# Altium project CCI_Mouse.PrjPcb
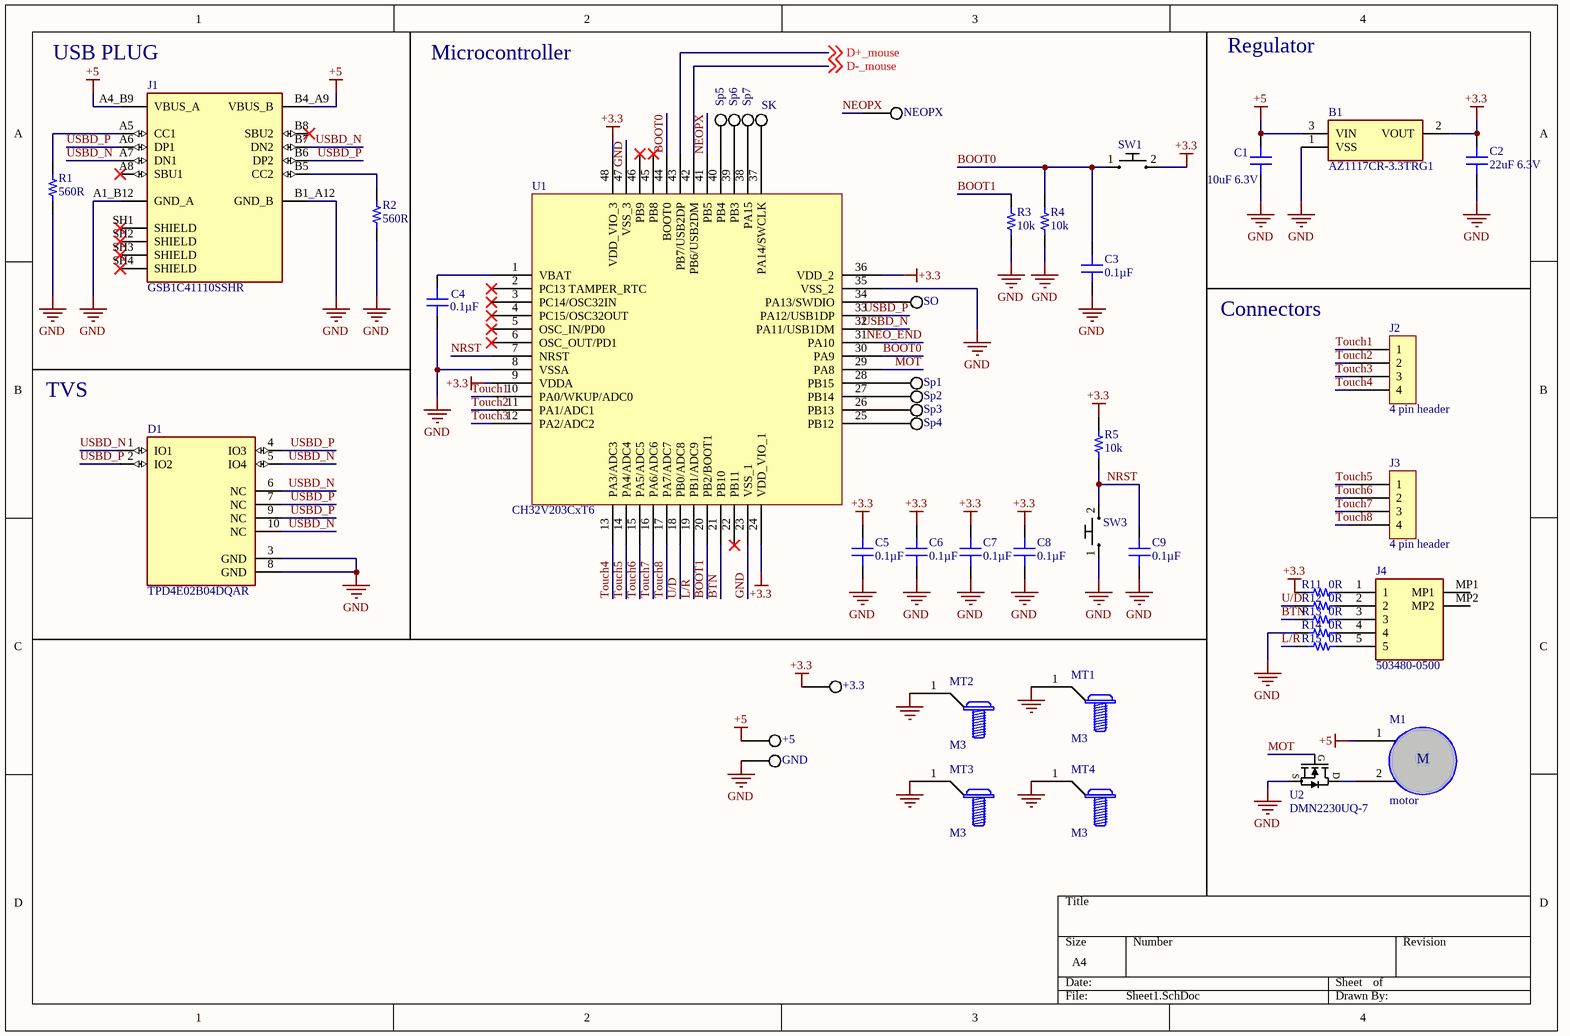
[diagram p0: Sheet1.SchDoc]
1 sheet, 47 parts. Net scope: global (net labels, ports and power ports of the same name join across sheets).
Board file: PCB1.PcbDoc

## Sheet Sheet1.SchDoc
size A4; SheetNumber: 1; SheetTotal: 2

### Parts
+3.3  TestPoint  [TP2020]  (value not drawn)
+5  TestPoint  [TP2020]  (value not drawn)
B1  AZ1117CR-3.3TRG1  [SOT89-3]
C1  10uF 6.3V  [CAP 0603_1608]
C2  22uF 6.3V  [CAP 0603_1608]
C3  0.1µF  [CAP 0603_1608]
C4  0.1µF  [CAP 0603_1608]
C5  0.1µF  [CAP 0603_1608]
C6  0.1µF  [CAP 0603_1608]
C7  0.1µF  [CAP 0603_1608]
C8  0.1µF  [CAP 0603_1608]
C9  0.1µF  [CAP 0603_1608]
D1  TPD4E02B04DQAR  [DIO_TPD4E02B04DQAR]
GND  TestPoint  [TP2020]  (value not drawn)
J1  GSB1C41110SSHR  [AMPHENOL_GSB1C41110SSHR]
J2  4 pin header  [4 pin header]
J3  4 pin header  [4 pin header]
J4  503480-0500  [5034800500]
M1  motor  [2 pin header]
MT1  M3  [M3_MT_HOLE]
MT2  M3  [M3_MT_HOLE]
MT3  M3  [M3_MT_HOLE]
MT4  M3  [M3_MT_HOLE]
NEOPX  TestPoint  [TP2020]  (value not drawn)
R1  560R  [RES 0603_1608]
R2  560R  [RES 0603_1608]
R3  10k  [RES 0603_1608]
R4  10k  [RES 0603_1608]
R5  10k  [RES 0603_1608]
R11  0R  [RES 0603_1608]
R12  0R  [RES 0603_1608]
R13  0R  [RES 0603_1608]
R14  0R  [RES 0603_1608]
R15  0R  [RES 0603_1608]
SK  TestPoint  [TP2020]  (value not drawn)
SO  TestPoint  [TP2020]  (value not drawn)
Sp1  TestPoint  [TP2020]  (value not drawn)
Sp2  TestPoint  [TP2020]  (value not drawn)
Sp3  TestPoint  [TP2020]  (value not drawn)
Sp4  TestPoint  [TP2020]  (value not drawn)
Sp5  TestPoint  [TP2020]  (value not drawn)
Sp6  TestPoint  [TP2020]  (value not drawn)
Sp7  TestPoint  [TP2020]  (value not drawn)
SW1  SPST_BUTTON  [3x4mmBTN]  (value not drawn)
SW3  SPST_BUTTON  [3x4mmBTN]  (value not drawn)
U1  CH32V203CxT6  [LQFP48]
U2  DMN2230UQ-7  [DMN2230UQ_DIO-M]

### Nets
+3.3: +3.3.TP B1.2(VOUT) C2.2 C5.2 C6.2 C7.2 C8.2 R5.2 R11.1 SW1.2 U1.9(VDDA) U1.24(VDD_VIO_1) U1.36(VDD_2) U1.48(VDD_VIO_3)
+5: +5.TP B1.3(VIN) C1.2 J1.A4_B9(VBUS_A) J1.B4_A9(VBUS_B) M1.1
GND: B1.1(VSS) C1.1 C2.1 C3.1 C4.1 C5.1 C6.1 C7.1 C8.1 C9.1 D1.3(GND) D1.8(GND) GND.TP J1.A1_B12(GND_A) J1.B1_A12(GND_B) MT1.1 MT2.1 MT3.1 MT4.1 R1.1 R2.1 R3.1 R4.1 R14.1 SW3.1 U1.8(VSSA) U1.23(VSS_1) U1.35(VSS_2) U1.47(VSS_3) U2.3(S)
BOOT0: C3.2 R4.2 SW1.1 U1.30(PA9) U1.44(BOOT0)
BOOT1: R3.2 U1.20(PB2/BOOT1)
BTN: R13.1 U1.21(PB10)
D+_mouse: U1.43(PB7/USB2DP) ; off-sheet D+_mouse
D-_mouse: U1.42(PB6/USB2DM) ; off-sheet D-_mouse
L/R: R15.1 U1.19(PB1/ADC9)
MOT: U1.29(PA8) U2.2(G)
NEO_END: U1.31(PA10)
NEOPX: NEOPX.TP U1.41(PB5)
NRST: C9.2 R5.1 SW3.2 U1.7(NRST)
Touch1: J2.1 U1.10(PA0/WKUP/ADC0)
Touch2: J2.2 U1.11(PA1/ADC1)
Touch3: J2.3 U1.12(PA2/ADC2)
Touch4: J2.4 U1.13(PA3/ADC3)
Touch5: J3.1 U1.14(PA4/ADC4)
Touch6: J3.2 U1.15(PA5/ADC5)
Touch7: J3.3 U1.16(PA6/ADC6)
Touch8: J3.4 U1.17(PA7/ADC7)
U/D: R12.1 U1.18(PB0/ADC8)
USBD_N: D1.1(IO1) D1.5(IO4) D1.6(NC) D1.10(NC) J1.A7(DN1) J1.B7(DN2) U1.32(PA11/USB1DM)
USBD_P: D1.2(IO2) D1.4(IO3) D1.7(NC) D1.9(NC) J1.A6(DP1) J1.B6(DP2) U1.33(PA12/USB1DP)
NetC4_2: C4.2 U1.1(VBAT)
NetJ1_A5: J1.A5(CC1) R1.2
NetJ1_B5: J1.B5(CC2) R2.2
NetJ4_1: J4.1 R11.2
NetJ4_2: J4.2 R12.2
NetJ4_3: J4.3 R13.2
NetJ4_4: J4.4 R14.2
NetJ4_5: J4.5 R15.2
NetM1_2: M1.2 U2.1(D)
NetSK_TP: SK.TP U1.37(PA14/SWCLK)
NetSO_TP: SO.TP U1.34(PA13/SWDIO)
NetSp1_TP: Sp1.TP U1.28(PB15)
NetSp2_TP: Sp2.TP U1.27(PB14)
NetSp3_TP: Sp3.TP U1.26(PB13)
NetSp4_TP: Sp4.TP U1.25(PB12)
NetSp5_TP: Sp5.TP U1.40(PB4)
NetSp6_TP: Sp6.TP U1.39(PB3)
NetSp7_TP: Sp7.TP U1.38(PA15)

Not connected (* = marked no-connect by the designer): J1 A8(SBU1)* B8(SBU2)* SH1(SHIELD)* SH2(SHIELD)* SH3(SHIELD)* SH4(SHIELD)*; J4 MP1 MP2; U1 2(PC13_TAMPER_RTC)* 3(PC14/OSC32IN)* 4(PC15/OSC32OUT)* 5(OSC_IN/PD0)* 6(OSC_OUT/PD1)* 22(PB11)* 45(PB8)* 46(PB9)*

### Notes on the sheet
- (near J1) USB PLUG
- Microcontroller
- Regulator
- Connectors
- TVS
- (in symbol VibrationMotor) M

### Library data of the parts
+3.3 +5 GND NEOPX SK SO Sp1-Sp7 = JMP-RTZL7I: PC TEST POINT MINIATURE; Manufacturer: Keystone Electronics; SCH_Comment: 5015 TestPoint; Part Number: JMP-RTZL7I; Supplier 1: DigiKey; Supplier Part Number 1: 36-5015TR-ND
B1 = TRS-RTZP45: 3.3v LDO Voltage regulator; Manufacturer_Name: Torex; Manufacturer_Part_Number: XC6206P331MR-G; Geometry.Height: 1.3mm; SCH_Comment: AZ1117CR33; Mouser Part Number: 865-XC6206P331MR-G; Mouser Price/Stock: https://www.mouser.co.uk/ProductDetail/Torex-Semiconductor/XC6206P331MR-G?qs=AsjdqWjXhJ%252B7jjWBpr1yow%3D%3D; Datasheet Link: https://www.torexsemi.com/file/xc6206/XC6206.pdf; Part Number: TRS-RTZP45; Supplier 1: Digi-key; JLC PartNumber: C460428; Supplier Part Number 1: AZ1117CR-3.3TRG1DICT-ND
C1 = CAP0603-RU10OA: CAP CER 10uF; Manufacturer: YAGEO; Tolerance: ±10%; Part Number: CAP0603-RU10OA; SCH_Comment: 10uF 6.3V; Value: 10uF; Rated Voltage: 6.3V; Supplier 1: Digi-Key; Supplier Part Number 1: 311-1781-1-ND; JLC PartNumber: C19702; Size: 0603 (1608 Metric)
C2 = CAP0603-SAQ85G: 6.3V 22uF X5R ±20% 0603 Multilayer Ceramic Capacitors MLCC - SMD/SMT ROHS; Manufacturer: Samsung Electro-Mechanics; Part Number: CAP0603-SAQ85G; SCH_Comment: 22uF 6.3V; Value: 22uF; Tolerance: ±20%; Rated Voltage: 6.3V; Supplier 1: Digi-Key; JLC PartNumber: C59461
C3-C9 = CAP-RTZP49: CAP CER SMD 0603 .1UF 10% X7R 25; Manufacturer: Samsung Electro-Mechanics; Rated Voltage: 50V; Part Number: CAP-RTZP49; SCH_Comment: 0.1µF; Value: 0.1µF; Tolerance: ±10%; Supplier 1: Digi-key; Supplier Part Number 1: 1276-CL10B104KB8NNNLCT-ND; Size: 0603 (1608 Metric); JLC PartNumber: C14663
D1 = DIO-RTZP4I: ESD protection diode; MF: Texas Instruments; Value: *; MP: TPD4E02B04DQAR; Package: USON-10 Texas Instruments; Purchase-URL: https://pricing.snapeda.com/search/part/TPD4E02B04DQAR/?ref=eda; SnapEDA_Link: https://www.snapeda.com/parts/TPD4E02B04DQAR/Texas%20Instruments/view-part/576424/?ref=snap; Check_prices: https://www.snapeda.com/parts/TPD4E02B04DQAR/Texas%20Instruments/view-part/576424/?ref=eda; Digi-Key_Part_Number: 296-43875-1-ND; Part Number: DIO-RTZP4I; SCH_Comment: TPD4E02B04; Supplier 1: Digikey; Supplier Part Number 1: 296-43875-2-ND; JLC PartNumber: C106794
J1 = USB_16p_SMT: 16 pin usb type c right angle female connector; Manufacturer: Amphenol; MF: Amphenol Canada; SCH_Comment: USB-C; SnapEDA_Link: https://www.snapeda.com/parts/GSB1C41110SSHR/Amphenol/view-part/?ref=snap; Package: None; Value: *; MP: GSB1C41110SSHR; Check_prices: https://www.snapeda.com/parts/GSB1C41110SSHR/Amphenol/view-part/?ref=eda; Part Number: USB_16p_SMT
J2 J3 = 4PinHeader: Manufacturer: Sullins Connector Solutions; Part Number: 4PinHeader; SCH_Comment: 4 pin header; Supplier 1: Digi-Key; Supplier Part Number 1: S7002-ND
J4 = 503480-0500: Connector; Manufacturer_Name: Molex; Height: 1.3mm; Manufacturer_Part_Number: 503480-0500; Mouser Part Number: 538-503480-0500; Mouser Price/Stock: https://www.mouser.co.uk/ProductDetail/Molex/503480-0500?qs=gt1LBUVyoHk%2Fe71glqHWvw%3D%3D
M1 = VibrationMotor: Vibrating motor; Manufacturer: ChingChong; SCH_Comment: Vibrator; Part Number: VibrationMotor
MT1-MT4 = NSP-M3: M3 pounting screw; Part Number: NSP-M3; SCH_Comment: M3
R1 R2 = RES-RTZP5N: RES SMD 560 OHM 1% 1/10W 0603; Manufacturer: Panasonic Electronic Components; Value: 560; Power (Watts): 0.1W, 1/10W; Temperature Coefficient: ±100ppm/°C; Part Number: RES-RTZP5N; SCH_Comment: 560R; Tolerance: ±1%; Supplier 1: Digi-key; Supplier Part Number 1: P560HCT-ND; Composition: Thick Film; Features: Automotive AEC-Q200; JLC PartNumber: C23204; Operating Temperature: -55°C ~ 155°C; Size: 0603 (1608 Metric)
R3-R5 = RES-RTZP5R: RES SMD 10K OHM 1% 1/10W 0603; Manufacturer: Panasonic Electronic Components; Power (Watts): 0.1W, 1/10W; Temperature Coefficient: ±100ppm/°C; Part Number: RES-RTZP5R; SCH_Comment: 10k; Value: 10k; Tolerance: ±1%; Supplier 1: Digi-key; Supplier Part Number 1: P10.0KHCT-ND; Composition: Thick Film; Features: Automotive AEC-Q200; Operating Temperature: -55°C ~ 155°C; Size: 0603 (1608 Metric); JLC PartNumber: C25804
R11-R15 = ERJ-3GEY0R00V: RES SMD 0 OHM JUMPER 1/10W 0603; Manufacturer: Panasonic Electronic Components; Value: 0; Temperature Coefficient: ±200ppm/°C; Part Number: ERJ-3GEY0R00V; SCH_Comment: 0R; Tolerance: --; Supplier 1: Digi-key; Supplier Part Number 1: P0.0GCT-ND; Power (Watts): 1/10W; Features: Automotive AEC-Q200; Operating Temperature: -55°C ~ 155°C; Size: 0603 (1608 Metric)
SW1 SW3 = BTN-000001: 50mA Brick nogging SPST 12V SMD,3x4mm Tactile Switches ROHS; Manufacturer: XUNPU / XUNPU; SCH_Comment: Button; Part Number: BTN-000001; Supplier 1: DigiKey; Supplier Part Number 1: 2449-CS1213AGF160DKR-ND; JLC PartNumber: C455280
U1 = MCU-RV4Q62: 32bit RISC-V MCU 144MHz; Manufacturer: WCH-IC; Part Number: MCU-RV4Q62; SCH_Comment: CH32V203CxT6; Supplier Part Number 1: CH32V203C8T6; JLC PartNumber: C3001172; Supplier 1: Alibaba
U2 = DMN2230UQ-7: NPN mosfet; Mfr_Name: Diodes Inc; SCH_Comment: Mosfet N; Part Number: DMN2230UQ-7